# Altium schematic sheet pulseAmplifier.SchDoc
size A4
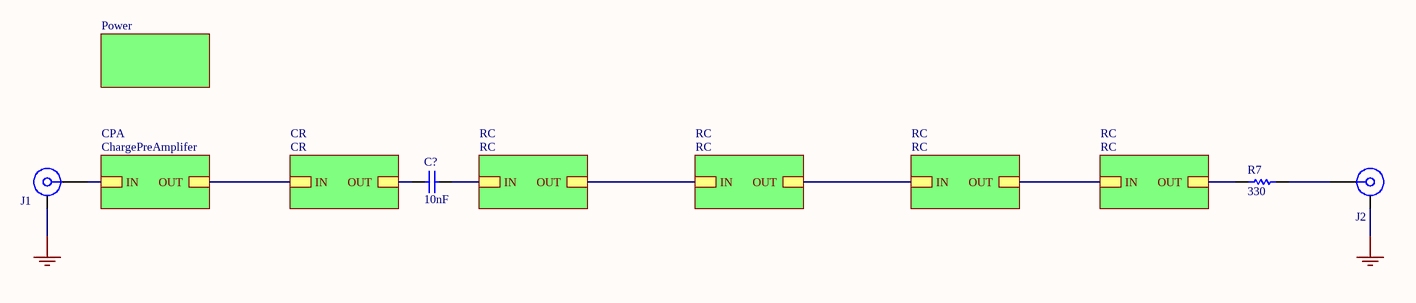
[diagram p0: pulseAmplifier.SchDoc]

## Parts
C?  10nF  [CAPC0603(1608)100_N]
J1  32K145-400L5  [ROS-32K145-400L5_V]  (value not drawn)
J2  32K145-400L5  [ROS-32K145-400L5_V]  (value not drawn)
R7  330  [RESC0603(1608)_N]

## Sub-sheets
CPA = ChargePreAmplifer: IN, OUT
CR = CR: IN, OUT
RC = RC: IN, OUT
RC = RC: IN, OUT
RC = RC: IN, OUT
RC = RC: IN, OUT
? = Power: no entries

## Nets
GND: J1.MP J2.MP
NetC?_1: C?.1 ; sheet RC/IN
NetC?_2: C?.2 ; sheet CR/OUT
NetJ1_1: J1.1 ; sheet CPA/IN
NetJ2_1: J2.1 R7.2
NetR7_1: R7.1 ; sheet RC/OUT
(unnamed): sheet CPA/OUT, sheet CR/IN
(unnamed): sheet RC/OUT, sheet RC/IN
(unnamed): sheet RC/OUT, sheet RC/IN
(unnamed): sheet RC/OUT, sheet RC/IN

## Library data of the parts
C? = CMP-1035-02589-1: 10nF Film; Value: 100nF; Case-EIA: 0603; Rated Voltage: 25 V; Tolerance: Â±20%; Case-Metric: 1608; Max Thickness: 1 mm; Technology: SMT
J1 J2 = CMP-0751-00004-2: SMA Right Angle Jack, Edge Mount, Up to 18 GHz, -55 to 155 degC; Manufacturer: Rosenberger; Desgin Note 2: For more information about DRC setting, please look at following webpage, http://techdocs.altium.com/display/SCRT/Design+Rule+for+Edge-Mount+Connectors; Design Note 1: Footprint in library is a generic example - only application specific footprint delivers High Performance; ComponentLink5Description: Webshop / RFQ; ComponentLink5URL: http://www.rosenberger.com/en/contact/sales/; ComponentLink3URL: http://rosenberger.de/ok/images/documents/db/32K145-400L5.pdf; DatasheetVersion: b00; ComponentLink2URL: http://rosenberger.de/ok/images/documents/db/32K145-400L5.pdf; ComponentLink4Description: Series Overview / Design Note; ComponentLink1Description: Manufacturer URL; PackageReference: 32K145-400L5; ComponentLink2Description: Datasheet; PartNumber: 32K145-400L5; PackageVersion: b00; PackageDescription: SMA Right Angle Jack, Edge Mount, 14.25 x 9.5 x 4.46 mm; ComponentLink3Description: Package Specification; ComponentLink1URL: http://www.rosenberger.de; ComponentLink4URL: http://rosenberger.de/ok/images/documents/spez/32.pdf; Mounting Technology: Surface Mount
R7 = CMP-1012-00397-1: 100R 0.1W 1% 0603 (1608 Metric)  SMD; Value: 100.00 Ohm; Case-EIA: 0603; Case-Metric: 1608; Technology: SMT; Tolerance: 1 %; Power: 0.1 W